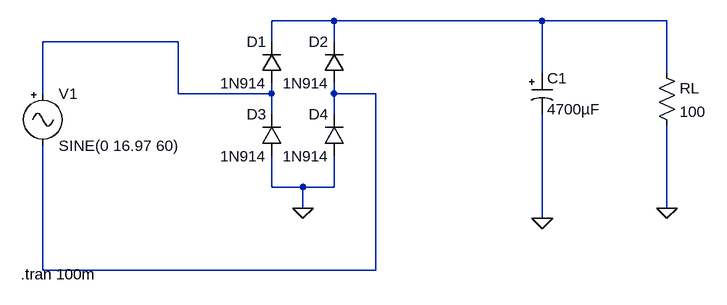
[diagram p0: schematic 2.2.1.asc]
2.2.1.asc, the LTspice schematic file:
Version 4
SHEET 1 880 680
WIRE 208 48 112 48
WIRE 528 48 208 48
WIRE 720 48 528 48
WIRE -32 80 -240 80
WIRE 112 80 112 48
WIRE 208 80 208 48
WIRE 528 128 528 48
WIRE 720 128 720 48
WIRE -240 160 -240 80
WIRE -32 160 -32 80
WIRE 112 160 112 144
WIRE 112 160 -32 160
WIRE 208 160 208 144
WIRE 272 160 208 160
WIRE 112 192 112 160
WIRE 208 192 208 160
WIRE 112 304 112 256
WIRE 160 304 112 304
WIRE 208 304 208 256
WIRE 208 304 160 304
WIRE 160 336 160 304
WIRE 720 336 720 208
WIRE 528 352 528 192
WIRE -240 432 -240 240
WIRE 272 432 272 160
WIRE 272 432 -240 432
FLAG 160 336 0
FLAG 720 336 0
FLAG 528 352 0
SYMBOL diode 128 256 R180
WINDOW 0 24 64 Left 2
WINDOW 3 24 0 Left 2
SYMATTR InstName D3
SYMATTR Value 1N914
SYMBOL diode 128 144 R180
WINDOW 0 24 64 Left 2
WINDOW 3 24 0 Left 2
SYMATTR InstName D1
SYMATTR Value 1N914
SYMBOL diode 224 144 R180
WINDOW 0 24 64 Left 2
WINDOW 3 24 0 Left 2
SYMATTR InstName D2
SYMATTR Value 1N914
SYMBOL diode 224 256 R180
WINDOW 0 24 64 Left 2
WINDOW 3 24 0 Left 2
SYMATTR InstName D4
SYMATTR Value 1N914
SYMBOL res 704 112 R0
SYMATTR InstName RL
SYMATTR Value 100
SYMBOL Misc\\signal -240 144 R0
WINDOW 123 0 0 Left 0
WINDOW 39 0 0 Left 0
SYMATTR InstName V1
SYMATTR Value SINE(0 16.97 60)
SYMBOL polcap 512 128 R0
SYMATTR InstName C1
SYMATTR Value 4700µF
TEXT -274 438 Left 2 !.tran 100m

The netlist it stands for:
* 2.2.1.asc
D3 0 N002 1N914
D1 N002 N001 1N914
D2 N003 N001 1N914
D4 0 N003 1N914
RL N001 0 100
V1 N002 N003 SINE(0 16.97 60)
C1 N001 0 4700µF
.model D D
.lib standard.dio
.tran 100m
.backanno
.end